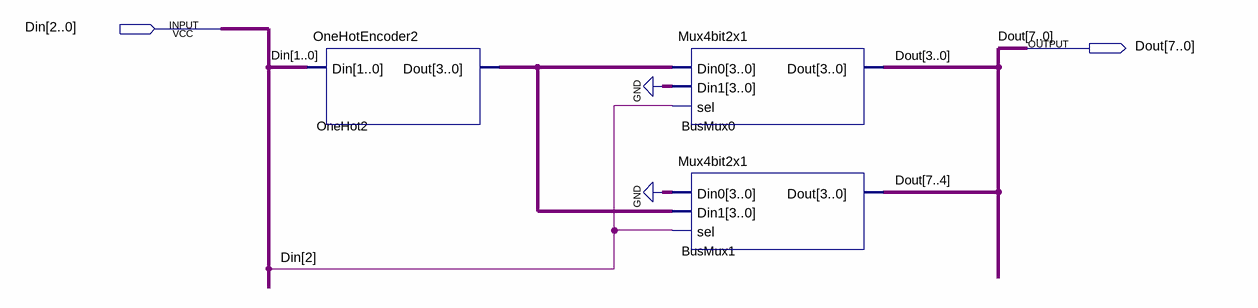
[diagram p0: schematic sheet]
// Quartus schematic OneHotEncoder3.bdf as structural Verilog: 3 symbols, 2 pins
module OneHotEncoder3 (
  input  [2:0] Din,
  output [7:0] Dout
);

  wire [3:0] OneHot2_dout;

  OneHotEncoder2 OneHot2 (.Din(Din[1:0]), .Dout(OneHot2_dout));
  Mux4bit2x1 BusMux0 (.Din0(OneHot2_dout), .Din1(4'b0000), .sel(Din[2]), .Dout(Dout[3:0]));
  Mux4bit2x1 BusMux1 (.Din0(4'b0000), .Din1(OneHot2_dout), .sel(Din[2]), .Dout(Dout[7:4]));
endmodule
